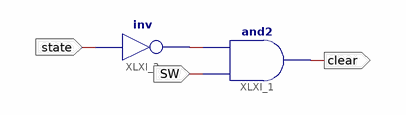
[diagram p0: schematic sheet 1]
// Xilinx ISE schematic Clear.sch (spartan6) as structural Verilog: 2 symbols, 3 ports
module Clear (
  input  SW,
  input  state,
  output clear
);

  wire XLXN_1;

  and XLXI_1 (clear, SW, XLXN_1);
  not XLXI_2 (XLXN_1, state);
endmodule
